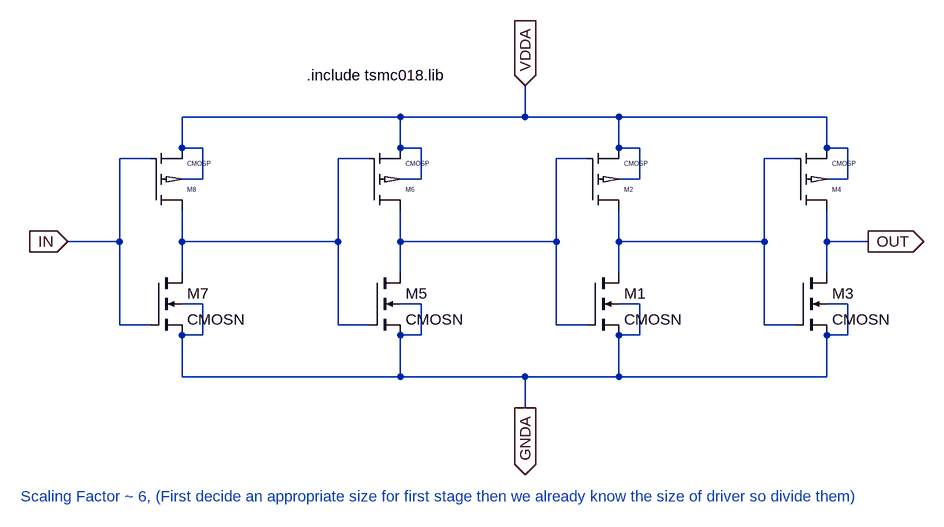
[diagram p0: schematic Digital_Buffers.asc]
Digital_Buffers.asc, the LTspice schematic file:
Version 4
SHEET 1 880 680
WIRE -128 -32 -464 -32
WIRE 64 -32 64 -80
WIRE 64 -32 -128 -32
WIRE 208 -32 64 -32
WIRE 528 -32 208 -32
WIRE -464 16 -464 -32
WIRE -432 16 -464 16
WIRE -128 16 -128 -32
WIRE -96 16 -128 16
WIRE 208 16 208 -32
WIRE 240 16 208 16
WIRE 528 16 528 -32
WIRE 560 16 528 16
WIRE -512 32 -560 32
WIRE -176 32 -224 32
WIRE 160 32 112 32
WIRE 480 32 432 32
WIRE -432 64 -432 16
WIRE -432 64 -464 64
WIRE -96 64 -96 16
WIRE -96 64 -128 64
WIRE 240 64 240 16
WIRE 240 64 208 64
WIRE 560 64 560 16
WIRE 560 64 528 64
WIRE -560 160 -560 32
WIRE -560 160 -640 160
WIRE -464 160 -464 112
WIRE -224 160 -224 32
WIRE -224 160 -464 160
WIRE -128 160 -128 112
WIRE 112 160 112 32
WIRE 112 160 -128 160
WIRE 208 160 208 112
WIRE 432 160 432 32
WIRE 432 160 208 160
WIRE 528 160 528 112
WIRE 592 160 528 160
WIRE -464 208 -464 160
WIRE -128 208 -128 160
WIRE 208 208 208 160
WIRE 528 208 528 160
WIRE -432 256 -464 256
WIRE -96 256 -128 256
WIRE 240 256 208 256
WIRE 560 256 528 256
WIRE -560 288 -560 160
WIRE -512 288 -560 288
WIRE -224 288 -224 160
WIRE -176 288 -224 288
WIRE 112 288 112 160
WIRE 160 288 112 288
WIRE 432 288 432 160
WIRE 480 288 432 288
WIRE -432 304 -432 256
WIRE -432 304 -464 304
WIRE -96 304 -96 256
WIRE -96 304 -128 304
WIRE 240 304 240 256
WIRE 240 304 208 304
WIRE 560 304 560 256
WIRE 560 304 528 304
WIRE -464 368 -464 304
WIRE -128 368 -128 304
WIRE -128 368 -464 368
WIRE 64 368 -128 368
WIRE 208 368 208 304
WIRE 208 368 64 368
WIRE 528 368 528 304
WIRE 528 368 208 368
WIRE 64 416 64 368
FLAG 64 -80 VDDA
IOPIN 64 -80 In
FLAG 64 416 GNDA
IOPIN 64 416 Out
FLAG -640 160 IN
IOPIN -640 160 In
FLAG 592 160 OUT
IOPIN 592 160 Out
SYMBOL cmosn 160 208 R0
SYMATTR InstName M1
SYMATTR Value2 l=180n w=144u
SYMBOL cmosp 160 112 M180
SYMATTR InstName M2
SYMATTR Value2 l=180n w=720u
SYMBOL cmosn 480 208 R0
SYMATTR InstName M3
SYMATTR Value2 l=180n w=864u
SYMBOL cmosp 480 112 M180
SYMATTR InstName M4
SYMATTR Value2 l=180n w=4320u
SYMBOL cmosn -176 208 R0
SYMATTR InstName M5
SYMATTR Value2 l=180n w=24u
SYMBOL cmosp -176 112 M180
SYMATTR InstName M6
SYMATTR Value2 l=180n w=120u
SYMBOL cmosn -512 208 R0
SYMATTR InstName M7
SYMATTR Value2 l=180n w=4u
SYMBOL cmosp -512 112 M180
SYMATTR InstName M8
SYMATTR Value2 l=180n w=20u
TEXT -712 552 Left 2 ;Scaling Factor ~ 6, (First decide an appropriate size for first stage then we already know the size of driver so divide them)
TEXT -272 -96 Left 2 !.include tsmc018.lib

The netlist it stands for:
* Digital_Buffers.asc
M1 N003 N002 GNDA GNDA CMOSN l=180n w=144u
M2 N003 N002 VDDA VDDA CMOSP l=180n w=720u
M3 OUT N003 GNDA GNDA CMOSN l=180n w=864u
M4 OUT N003 VDDA VDDA CMOSP l=180n w=4320u
M5 N002 N001 GNDA GNDA CMOSN l=180n w=24u
M6 N002 N001 VDDA VDDA CMOSP l=180n w=120u
M7 N001 IN GNDA GNDA CMOSN l=180n w=4u
M8 N001 IN VDDA VDDA CMOSP l=180n w=20u
.model NMOS NMOS
.model PMOS PMOS
.lib standard.mos
* Scaling Factor ~ 6, (First decide an appropriate size for first stage then we already know the size of driver so divide them)
.include tsmc018.lib
.lib tsmc018.lib
.backanno
.end